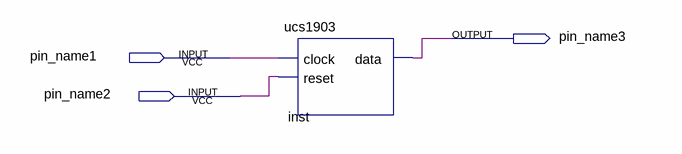
[diagram p0: schematic sheet]
// Quartus schematic ucs1903_complete.bdf as structural Verilog: 1 symbols, 3 pins
module ucs1903_complete (
  input  pin_name1,
  input  pin_name2,
  output pin_name3
);

  ucs1903 inst (.clock(pin_name1), .reset(pin_name2), .data(pin_name3));
endmodule
